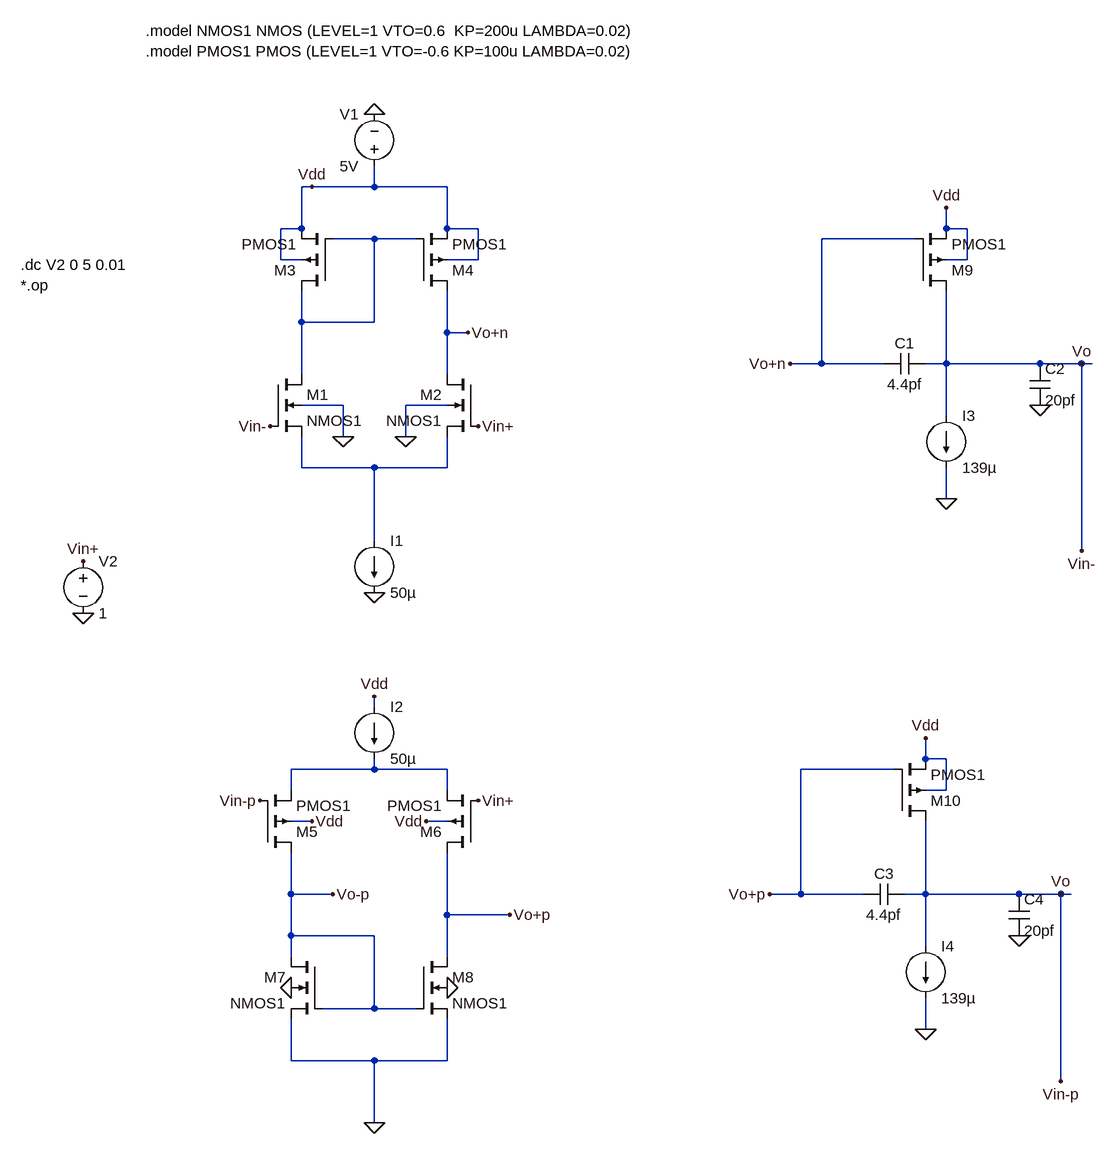
[diagram p0: schematic Rail_to_rail_opamp.asc]
Rail_to_rail_opamp.asc, the LTspice schematic file:
Version 4.1
SHEET 1 1328 1148
WIRE 112 -336 96 -336
WIRE 208 -336 208 -368
WIRE 208 -336 112 -336
WIRE 320 -336 208 -336
WIRE 96 -272 96 -336
WIRE 96 -272 64 -272
WIRE 320 -272 320 -336
WIRE 368 -272 320 -272
WIRE 1088 -272 1088 -304
WIRE 1120 -272 1088 -272
WIRE 208 -256 144 -256
WIRE 272 -256 208 -256
WIRE 1040 -256 896 -256
WIRE 64 -224 64 -272
WIRE 96 -224 64 -224
WIRE 368 -224 368 -272
WIRE 368 -224 320 -224
WIRE 1120 -224 1120 -272
WIRE 1120 -224 1088 -224
WIRE 96 -128 96 -176
WIRE 208 -128 208 -256
WIRE 208 -128 96 -128
WIRE 320 -112 320 -176
WIRE 352 -112 320 -112
WIRE 896 -64 896 -256
WIRE 896 -64 848 -64
WIRE 992 -64 896 -64
WIRE 1088 -64 1088 -176
WIRE 1088 -64 1056 -64
WIRE 1232 -64 1088 -64
WIRE 1296 -64 1232 -64
WIRE 1312 -64 1296 -64
WIRE 96 -48 96 -128
WIRE 320 -48 320 -112
WIRE 160 0 96 0
WIRE 320 0 256 0
WIRE 1088 16 1088 -64
WIRE 160 48 160 0
WIRE 256 48 256 0
WIRE 96 96 96 48
WIRE 208 96 96 96
WIRE 320 96 320 48
WIRE 320 96 208 96
WIRE 1088 144 1088 96
WIRE 208 208 208 96
WIRE 1296 224 1296 -64
WIRE 208 464 208 448
WIRE 1056 544 1056 512
WIRE 1088 544 1056 544
WIRE 208 560 208 544
WIRE 208 560 80 560
WIRE 320 560 208 560
WIRE 1008 560 864 560
WIRE 80 592 80 560
WIRE 320 592 320 560
WIRE 1088 592 1088 544
WIRE 1088 592 1056 592
WIRE 112 640 80 640
WIRE 320 640 288 640
WIRE 80 752 80 688
WIRE 144 752 80 752
WIRE 864 752 864 560
WIRE 864 752 816 752
WIRE 960 752 864 752
WIRE 1056 752 1056 640
WIRE 1056 752 1024 752
WIRE 1200 752 1056 752
WIRE 1264 752 1200 752
WIRE 1280 752 1264 752
WIRE 320 784 320 688
WIRE 416 784 320 784
WIRE 80 816 80 752
WIRE 208 816 80 816
WIRE 1056 832 1056 752
WIRE 80 848 80 816
WIRE 320 848 320 784
WIRE 208 928 208 816
WIRE 208 928 128 928
WIRE 272 928 208 928
WIRE 1056 960 1056 912
WIRE 80 1008 80 944
WIRE 208 1008 80 1008
WIRE 320 1008 320 944
WIRE 320 1008 208 1008
WIRE 1264 1040 1264 752
WIRE 208 1104 208 1008
FLAG 208 -448 0
FLAG 160 48 0
FLAG 256 48 0
FLAG 112 -336 Vdd
FLAG 368 32 Vin+
FLAG 48 32 Vin-
FLAG 208 288 0
FLAG 208 448 Vdd
FLAG 208 1104 0
FLAG 320 896 0
FLAG 80 896 0
FLAG 368 608 Vin+
FLAG 32 608 Vin-p
FLAG 352 -112 Vo+n
FLAG 1088 -304 Vdd
FLAG 1296 -64 Vo
FLAG 1232 0 0
FLAG 848 -64 Vo+n
FLAG 1088 144 0
FLAG 1296 224 Vin-
FLAG -240 320 0
FLAG -240 240 Vin+
FLAG 1056 512 Vdd
FLAG 1264 752 Vo
FLAG 1200 816 0
FLAG 1056 960 0
FLAG 1264 1040 Vin-p
FLAG 416 784 Vo+p
FLAG 144 752 Vo-p
FLAG 816 752 Vo+p
FLAG 112 640 Vdd
FLAG 288 640 Vdd
SYMBOL nmos4 48 -48 R0
SYMATTR InstName M1
SYMATTR Value NMOS1
SYMATTR Value2 l=300n w=300n
SYMBOL nmos4 368 -48 M0
SYMATTR InstName M2
SYMATTR Value NMOS1
SYMATTR Value2 l=300n w=300n
SYMBOL voltage 208 -352 R180
WINDOW 0 24 96 Left 2
WINDOW 3 24 16 Left 2
WINDOW 123 0 0 Left 0
WINDOW 39 0 0 Left 0
SYMATTR InstName V1
SYMATTR Value 5V
SYMBOL pmos4 144 -176 R180
SYMATTR InstName M3
SYMATTR Value PMOS1
SYMATTR Value2 l=300n w=600n
SYMBOL pmos4 272 -176 M180
SYMATTR InstName M4
SYMATTR Value PMOS1
SYMATTR Value2 l=300n w=600n
SYMBOL current 208 208 R0
WINDOW 123 0 0 Left 0
WINDOW 39 0 0 Left 0
SYMATTR InstName I1
SYMATTR Value 50µ
SYMBOL pmos4 32 688 M180
SYMATTR InstName M5
SYMATTR Value PMOS1
SYMATTR Value2 l=300n w=600n
SYMBOL pmos4 368 688 R180
SYMATTR InstName M6
SYMATTR Value PMOS1
SYMATTR Value2 l=300n w=600n
SYMBOL current 208 464 R0
WINDOW 123 0 0 Left 0
WINDOW 39 0 0 Left 0
SYMATTR InstName I2
SYMATTR Value 50µ
SYMBOL nmos4 128 848 M0
SYMATTR InstName M7
SYMATTR Value NMOS1
SYMATTR Value2 l=300n w=600n
SYMBOL nmos4 272 848 R0
SYMATTR InstName M8
SYMATTR Value NMOS1
SYMATTR Value2 l=300n w=600n
SYMBOL cap 1056 -80 R90
WINDOW 0 0 32 VBottom 2
WINDOW 3 32 32 VTop 2
SYMATTR InstName C1
SYMATTR Value 4.4pf
SYMBOL pmos4 1040 -176 M180
SYMATTR InstName M9
SYMATTR Value PMOS1
SYMATTR Value2 l=300n w=3300n
SYMBOL cap 1216 -64 R0
SYMATTR InstName C2
SYMATTR Value 20pf
SYMBOL current 1088 16 R0
WINDOW 123 0 0 Left 0
WINDOW 39 0 0 Left 0
SYMATTR InstName I3
SYMATTR Value 139µ
SYMBOL voltage -240 224 R0
WINDOW 123 0 0 Left 0
WINDOW 39 0 0 Left 0
SYMATTR InstName V2
SYMATTR Value 1
SYMBOL cap 1024 736 R90
WINDOW 0 0 32 VBottom 2
WINDOW 3 32 32 VTop 2
SYMATTR InstName C3
SYMATTR Value 4.4pf
SYMBOL pmos4 1008 640 M180
SYMATTR InstName M10
SYMATTR Value PMOS1
SYMATTR Value2 l=300n w=3300n
SYMBOL cap 1184 752 R0
SYMATTR InstName C4
SYMATTR Value 20pf
SYMBOL current 1056 832 R0
WINDOW 123 0 0 Left 0
WINDOW 39 0 0 Left 0
SYMATTR InstName I4
SYMATTR Value 139µ
TEXT -336 -216 Left 2 !.dc V2 0 5 0.01\n*.op
TEXT -144 -576 Left 2 !.model NMOS1 NMOS (LEVEL=1 VTO=0.6  KP=200u LAMBDA=0.02)\n.model PMOS1 PMOS (LEVEL=1 VTO=-0.6 KP=100u LAMBDA=0.02)

The netlist it stands for:
* Rail_to_rail_opamp.asc
M1 N001 Vo N002 0 NMOS1 l=300n w=300n
M2 Vo+n Vin+ N002 0 NMOS1 l=300n w=300n
V1 Vdd 0 5V
M3 N001 N001 Vdd Vdd PMOS1 l=300n w=600n
M4 Vo+n N001 Vdd Vdd PMOS1 l=300n w=600n
I1 N002 0 50µ
M5 Vo-p Vo N003 Vdd PMOS1 l=300n w=600n
M6 Vo+p Vin+ N003 Vdd PMOS1 l=300n w=600n
I2 Vdd N003 50µ
M7 Vo-p Vo-p 0 0 NMOS1 l=300n w=600n
M8 Vo+p Vo-p 0 0 NMOS1 l=300n w=600n
C1 Vo Vo+n 4.4pf
M9 Vo Vo+n Vdd Vdd PMOS1 l=300n w=3300n
C2 Vo 0 20pf
I3 Vo 0 139µ
V2 Vin+ 0 1
C3 Vo Vo+p 4.4pf
M10 Vo Vo+p Vdd Vdd PMOS1 l=300n w=3300n
C4 Vo 0 20pf
I4 Vo 0 139µ
.model NMOS NMOS
.model PMOS PMOS
.lib standard.mos
.dc V2 0 5 0.01
*.op
.model NMOS1 NMOS (LEVEL=1 VTO=0.6  KP=200u LAMBDA=0.02)
.model PMOS1 PMOS (LEVEL=1 VTO=-0.6 KP=100u LAMBDA=0.02)
.backanno
.end